# Altium schematic sheet connect.SchDoc: Bison-Board
size A4; DrawnBy: mzy2364; Revision: V1.4
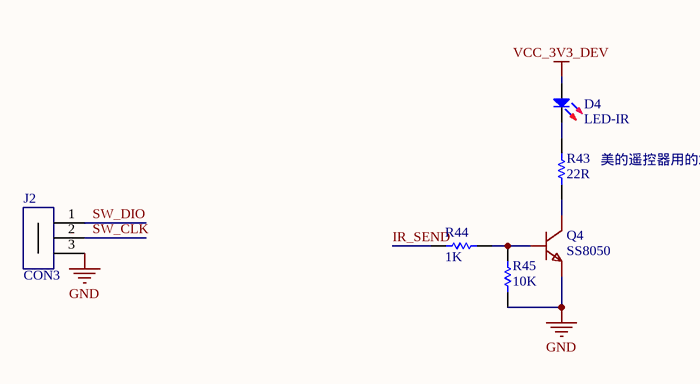
[diagram p0: connect.SchDoc]

## Parts
D4  LED-IR  [IR12-21C]
J2  CON3  [SMD_3P-1.25]
Q4  SS8050  [SOT-23]
R43  22R  [R 0603]
R44  1K  [R 0603]
R45  10K  [R 0603]

## Nets
GND: J2.3 Q4.2(E) R45.1
VCC_3V3_DEV: D4.1(A)
IR_SEND: R44.1
SW_CLK: J2.2
SW_DIO: J2.1
NetD4_2: D4.2(K) R43.2
NetQ4_1: Q4.1(B) R44.2 R45.2
NetQ4_3: Q4.3(C) R43.1

## Notes on the sheet
- 美的遥控器用的2R2

## Library data of the parts
Q4 = NPN
R43-R45 = RES